# Altium schematic sheet PSU_Disconnect.SchDoc: Power Supply (20-40V to 3v3 @ 0.1-0.6A)
size A3; DrawnBy: Jonn Dillon; DocumentNumber: 10; Revision: 01; SheetNumber: 10; SheetTotal: 10; Version: 01; Project: Battery Management System 2020; PageSetup: Record=PageOptions|CenterHorizontal=True|CenterVertical=True|PrintScale=0.97|XCorrection=1.00|YCorrection=1.00|PrintKind=0|BorderSize=5000000|LeftOffset=0|BottomOffset=0|Orientation=2|PaperLength=1000|PaperWidth=1000|Scale=100|PaperSource=7|PrintQuality=-4|MediaType=1|DitherType=10|PaperKind=A4|PrintScaleMode=1
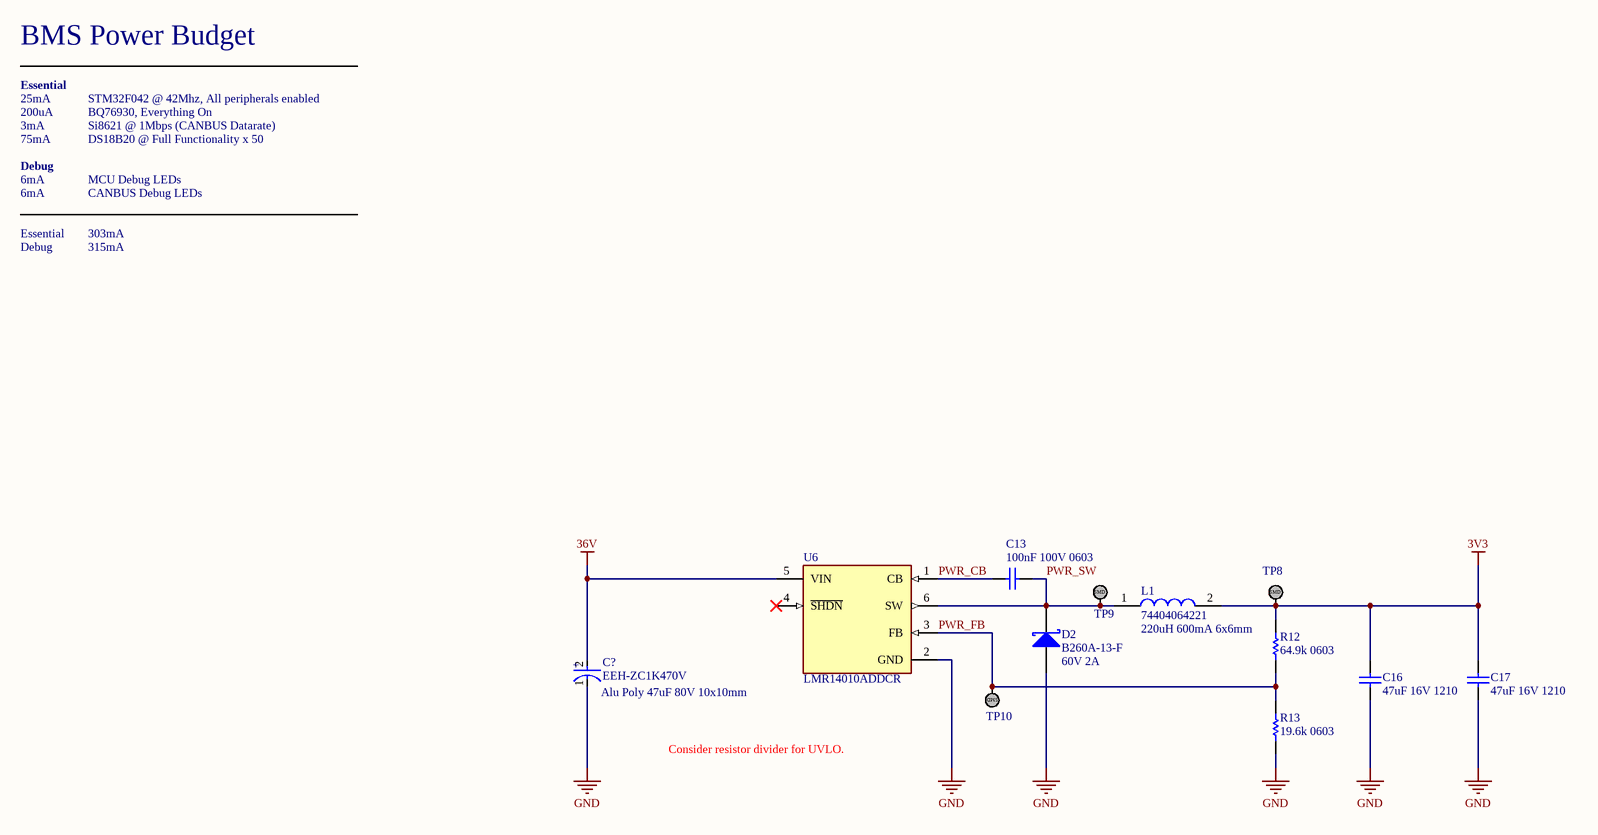
[diagram p0: PSU_Disconnect.SchDoc]

## Parts
C13  100nF 100V 0603  [CAPC1608X90X20ML10]
C16  47uF 16V 1210  [MURA-1210_H_2.7_L]
C17  47uF 16V 1210  [MURA-1210_H_2.7_L]
C?  EEH-ZC1K470V  [FP-ZCG-V-MFG]
D2  B260A-13-F  [DIOD-SMA-2_V]
L1  74404064221  [Inductor_6x6mm]
R12  64.9k 0603  [RESC1608X55X30ML15T15]
R13  19.6k 0603  [RESC1608X55X30ML15T15]
TP8  TestPoint_SMD  [TestPointSMD]  (value not drawn)
TP9  TestPoint_SMD  [TestPointSMD]  (value not drawn)
TP10  TestPoint_SMD  [TestPointSMD]  (value not drawn)
U6  LMR14010ADDCR  [FP-DDC0006A-MFG]

## Nets
3V3: C16.2 C17.2 L1.2 R12.2 TP8.1
36V: C?.2(A) U6.5(VIN)
GND: C16.1 C17.1 C?.1(C) D2.1(A) R13.1 U6.2(GND)
PWR_CB: C13.2 U6.1(CB)
PWR_FB: R12.1 R13.2 TP10.1 U6.3(FB)
PWR_SW: C13.1 D2.2(K) L1.1 TP9.1 U6.6(SW)

Not connected (* = marked no-connect by the designer): U6 4(~{SHDN})*

## Notes on the sheet
- BMS Power Budget
- 25mA
- 200uA
- Essential
- STM32F042 @ 42Mhz, All peripherals enabled
- BQ76930, Everything On
- 3mA
- 6mA
- Debug
- 75mA
- Si8621 @ 1Mbps (CANBUS Datarate)
- MCU Debug LEDs
- DS18B20 @ Full Functionality x 50
- CANBUS Debug LEDs
- 303mA
- 315mA
- (near L1) 220uH 600mA 6x6mm
- (near C?) Alu Poly 47uF 80V 10x10mm
- (near D2) 60V 2A
- Consider resistor divider for UVLO.
- Revision History:
- Sheet Title:
- Rev
- Date
- Description
- Project:
- Size:
- Drawn By:
- A3
- Number:
- Revision:
- Sheet
- Version:
- of
- QUT Motorsport
- O-120, Gardens Point
- 2 George Street
- Brisbane, QLD 4000
- Australia
- Print Date:
- Print Time:
- File Name:
- (in symbol CMP-05428-000002-1) +
- (in symbol TestPoint_SMD) SMD

## Library data of the parts
C13 = CMP-2000-04983-1: Chip Capacitor, 100 nF, +/- 10%, 100 V, -55 to 125 degC, 0603 (1608 Metric), RoHS, Tape and Reel; PCN Part Number: MLCCPartNumberChange30/Nov/2012; Manufacturer: TDK; Capacitance: 0.1µF; Kits: 445-9007-KIT-ND-KITCAPCERAUTO100V-600VSMD445-9006-KIT-ND-KITCAPCERAUTO100V-630VSMDSAMPLEKIT1006-ND-KITCAPCERAUTO100V-630V; Online Catalog: CGASeries,AutomotiveGeneral,MidandHighVoltage; Product Training Modules: CGASeriesforAutomotiveApplicationsSEAT,CCV,andTVCLDesignToolsGuidetoReplacinganElectrolyticCapacitorwithanMLCC; Featured Product: CGASeriesMLCCCapacitors; Other Names: 445-6938-1; Temperature Coefficient: X7S; RoHS Information: RoHSCertificate-MLCC; Package / Case: 0603(1608Metric); Mounting Type: SurfaceMount,MLCC; Size / Dimension: 0.063"Lx0.031"W(1.60mmx0.80mm); Applications: Automotive; Series: CGA; Package Reference: 603; Voltage - Rated: 100V; Lead Style: -; Datasheet URL: https://ciiva.com/datasheet-click-20384029?src=ciiva&sig=1463c8bc; Thickness (Max): 0.035"(0.90mm); Ratings: AEC-Q200; Standard Package: 1; Features: -; Family: CeramicCapacitors; Category: Capacitors; Tolerance: ±10%; Datasheet Version: Jan-16; Operating Temperature: -55degC~125degC; Manufacturer URL: http://www.tdk.com/; Packaging: CutTape(CT); Lead Spacing: -; Package Description: 2-Pin Surface Mount Device, Body 1.6 x 0.8 mm; Height - Seated (Max): -
C16 C17 = CMP-2000-06362-1: Cap Ceramic, 47 uF, +/- 10%, -55 to 85 degC, 2-Pin SMD (1210), RoHS, Tape and Reel; Manufacturer: Murata; Catalog Drawings: GRMSeries_1210_2.5; Capacitance: 47µF; Product Training Modules: High-CapMultilayerCeramicCapacitors; Temperature Coefficient: X5R; Online Catalog: GRMSeries; Other Names: 490-6539-6; Lead Style: -; Voltage Rating DC: 16V; Datasheet URL: http://psearch.en.murata.com/capacitor/product/GRM32ER61C476KE15%23.pdf; Package Description: 2-Pin Surface Mount Device, Body 3.2 x 2.5 mm; Applications: GeneralPurpose; Thickness (Max): 0.106"(2.70mm); Operating Temperature: -55°C~85°C; Mounting Technology: SurfaceMount; Category: Capacitors; Package / Case: 1210(3225Metric); Mounting Type: SurfaceMount,MLCC; Ratings: -; Package Reference: 1210; Height - Seated (Max): -; Series: GRM; Lead Spacing: -; Family: CeramicCapacitors; Datasheet Version: 04/2016; Tolerance: ±10%; Size / Dimension: 0.126"Lx0.098"W(3.20mmx2.50mm); Packaging: Digi-Reel®; Voltage - Rated: 16V; Standard Package: 1; Features: -; Manufacturer URL: http://www.murata.com/
C? = CMP-05428-000002-1: CAP ALUM POLY 47UF 20% 80V SMD; Manufacturer: Panasonic; Leakage Current: 37.6uA; Life: 100000Hours; Standoff Height: 0mm; Esr: 36mΩ; Material: Polymer; Dissipation Factor: 8%; Automotive Grade: Grade 1; Ripple Current: 1360mA; Footprint Url: https://industrial.panasonic.com/cdbs/www-data/pdf/RDD0000/DMD0000COL4.pdf; Digikey Description: CAP ALUM POLY 47UF 20% 80V SMD; Device Class L1: Passive Components; Category: Cap; Tolerance: 20%; Value: 47uF; Manufacturer Part Number: EEH-ZC1K470V; Device Class L3: Polymer Capacitors; Temperature Range Low: -55°C; RoHS: TRUE; Package: ZCG-V; Octopart: https://octopart.com/eeh-zc1k470v-panasonic-75386549; Device Class L2: Capacitors; Capacitance: 47uF; Voltage Rating: 80V; ComponentLink2Description: Datasheet; Temperature: -55°C to +125°C; Automotive: Yes; Temperature Range High: +125°C; Lead Free: Yes; ComponentLink2URL: https://industrial.panasonic.com/cdbs/www-data/pdf/RDD0000/ABA0000C1234.pdf; Mouser Description: Cap Aluminum 47uF 80V 20% (10 X 10.5mm) Cylindrical 0.036 Ohm 1360mA 4000 hr 125°C Emboss T/R; Height: 10.8mm
D2 = CMP-2000-04933-1: Schottky Barrier Rectifier, 60 V, 2 A, -65 to 150 degC, 2-Pin SMA, RoHS, Tape and Reel; If - Forward Current: 2A; Vf - Forward Voltage: 0.7V; Ir - Reverse Current: 500uA; Configuration: Single; Unit Weight: 0.002258oz; Brand: DiodesIncorporated; Vrrm - Repetitive Reverse Voltage: 60V; Ifsm - Forward Surge Current: 50A; Product Category: SchottkyDiodes&Rectifiers; Datasheet Version: Rev. 22-2, 07/2015; Maximum Operating Temperature: +150C; Product: SchottkyDiodes; Minimum Operating Temperature: -65C; Operating Temperature Range: -65Cto+150C; Termination Style: SMD/SMT; Package / Case: SMA; Factory Pack Quantity: 5000; Technology: Si; Height: 2.1mm; Type: SchottkyBarrierRectifier; Manufacturer URL: http://www.diodes.com/; Datasheet URL: http://www.diodes.com/_files/datasheets/ds13004.pdf; RoHS: True; Mounting Style: SMD/SMT; Length: 4.6mm; Series: B260; Package Reference: SMA-2; Packaging: Reel; Width: 2.92mm; Manufacturer: DiodesIncorporated; Package Description: 2-Pin Surface Mounted Assembly, Body 4.3 x 2.605 mm, Height 2.4 mm
L1 = 74404064221: FIXED IND 220UH 660MA 850 MOHM; ComponentLink1Description: Digikey; ComponentLink1URL: https://www.digikey.com.au/product-detail/en/w%C3%BCrth-elektronik/74404064221/732-7261-1-ND/5353241; ComponentLink2Description: LCSC A; ComponentLink2URL: https://lcsc.com/product-detail/Power-Inductors_Sunlord-SWPA6045S221MT_C91047.html; ComponentLink3Description: LCSC B; ComponentLink3URL: https://lcsc.com/product-detail/Power-Inductors_SXN-Shun-Xiang-Nuo-Elec-SMNR6045-221MT_C467145.html
R12 = CMP-2000-00605-1: Part Number: ERJ-3EKF6492V; Manufacturer: Panasonic
R13 = CMP-2000-00314-1: Part Number: ERJ-3EKF1962V; Manufacturer: Panasonic
U6 = CMP-04918-000056-1: IC REG BUCK ADJ 1A TSOT23-6; Manufacturer: Texas Instruments; Max Junction Temp: +125°C; Number Of Outputs: 1; Standoff Height: 0mm; Switching Frequency: 700kHz; Min Supply Voltage: 4V; Max Supply Voltage: 40V; Max Duty Cycle: 96%; Output Type: AdjustableProgrammable; Manufacturer Part Number: LMR14010ADDCR; Temperature: -40°C to +125°C; Output Current: 1A; Category: IC; Temperature Range High: +125°C; Lead Free: Yes; Switching Topology: Buck; Mouser Description: 4-V to 40-V, 1-A Step-Down Converter With High Efficiency Eco-Mode 6-SOT-23-THIN -40 to 125; Device Class L1: Integrated Circuits (ICs); Digikey Description: IC REG BUCK ADJ 1A TSOT23-6; Package: DDC0006A; Ipc Land Pattern Name: SOT95P280X110-6; Device Class L2: Power Management ICs; Temperature Range Low: -40°C; Height: 1.1mm; Device Class L3: Voltage Regulators - Switching; RoHS: TRUE; Automotive: No; Octopart: https://octopart.com/lmr14010addcr-texas+instruments-90753290; ComponentLink2URL: https://www.ti.com/lit/ds/symlink/lmr14010a.pdf; ComponentLink2Description: Datasheet